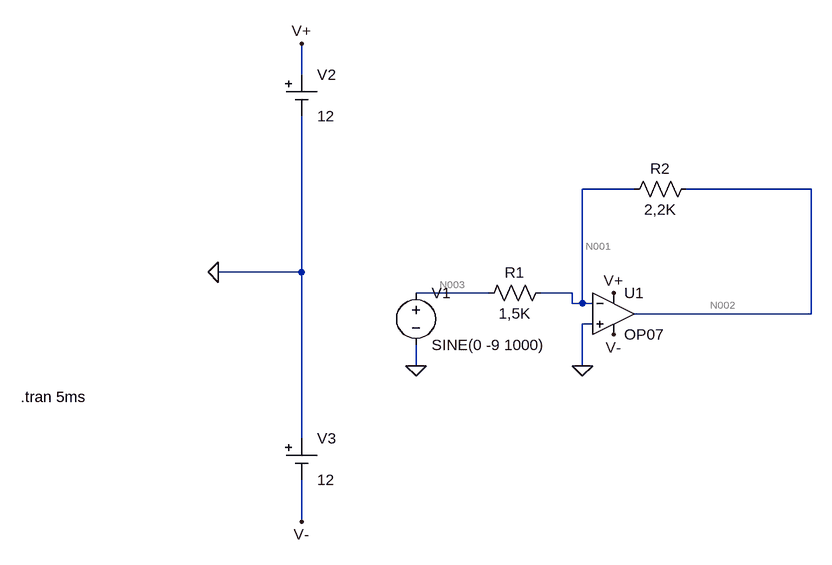
[diagram p0: schematic Draft2.asc]
Draft2.asc, the LTspice schematic file:
Version 4
SHEET 1 880 680
WIRE -272 -224 -272 -272
WIRE 240 -48 160 -48
WIRE 512 -48 320 -48
WIRE -272 80 -272 -160
WIRE -272 80 -400 80
WIRE 16 112 -96 112
WIRE 144 112 96 112
WIRE 144 128 144 112
WIRE 160 128 160 -48
WIRE 160 128 144 128
WIRE 176 128 160 128
WIRE 512 144 512 -48
WIRE 512 144 240 144
WIRE 176 160 160 160
WIRE -96 224 -96 192
WIRE 160 224 160 160
WIRE -272 336 -272 80
WIRE -272 464 -272 400
FLAG -400 80 0
FLAG -96 224 0
FLAG 160 224 0
FLAG -272 -272 V+
FLAG 208 112 V+
FLAG -272 464 V-
FLAG 208 176 V-
SYMBOL OpAmps\\OP07 208 80 R0
SYMATTR InstName U1
SYMBOL voltage -96 96 R0
WINDOW 123 0 0 Left 0
WINDOW 39 0 0 Left 0
SYMATTR InstName V1
SYMATTR Value SINE(0 -9 1000)
SYMBOL res 112 96 R90
WINDOW 0 0 56 VBottom 2
WINDOW 3 32 56 VTop 2
SYMATTR InstName R1
SYMATTR Value 1,5K
SYMBOL res 336 -64 R90
WINDOW 0 0 56 VBottom 2
WINDOW 3 32 56 VTop 2
SYMATTR InstName R2
SYMATTR Value 2,2K
SYMBOL Misc\\cell -272 -224 R0
WINDOW 123 0 0 Left 0
WINDOW 39 0 0 Left 0
SYMATTR InstName V2
SYMATTR Value 12
SYMBOL Misc\\cell -272 336 R0
WINDOW 123 0 0 Left 0
WINDOW 39 0 0 Left 0
SYMATTR InstName V3
SYMATTR Value 12
TEXT -704 272 Left 2 !.tran 5ms

The netlist it stands for:
* Draft2.asc
XU1 0 N001 V+ V- N002 LT1001  ; OP07, pins In+ In- V+ V- OUT
V1 N003 0 SINE(0 -9 1000)
R1 N001 N003 1,5K
R2 N002 N001 2,2K
V2 V+ 0 12
V3 0 V- 12
.tran 5ms
.lib LTC.lib
.backanno
.end

* Results of the author's LTspice run, read from the files saved beside the schematic
* Operating Point, zero values left out:
*   V(v+) = 12 V
*   V(v-) = -12 V
*   I(V3) = -2.25 mA
*   I(V2) = -2.25 mA
*   Ix(u1:3) = 2.25 mA
*   Ix(u1:4) = -2.25 mA
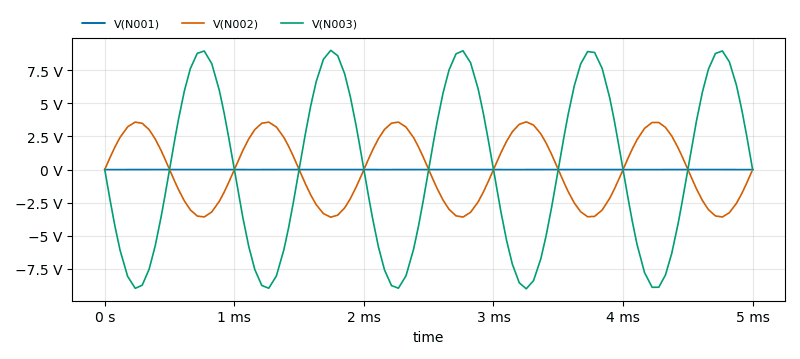
[diagram p1: Transient Analysis of Draft2.asc, plotted from the saved traces]
* Transient Analysis, 1 run:
*   V(N001): min -4.727 mV, max 4.303 mV, average 301.2 nV, rms 3.054 mV, last -4.304 mV
*   V(N002): min -3.597 V, max 3.599 V, average -97.83 µV, rms 2.534 V, last -6.026 mV
*   V(N003): min -8.998 V, max 8.994 V, average 245.8 µV, rms 6.336 V, last 0 V